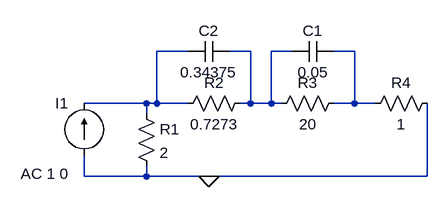
[diagram p0: schematic ej1.asc]
ej1.asc, the LTspice schematic file:
Version 4
SHEET 1 880 680
WIRE 96 32 48 32
WIRE 192 32 160 32
WIRE 256 32 224 32
WIRE 352 32 320 32
WIRE 32 112 -64 112
WIRE 48 112 48 32
WIRE 48 112 32 112
WIRE 96 112 48 112
WIRE 192 112 192 32
WIRE 192 112 176 112
WIRE 224 112 224 32
WIRE 224 112 192 112
WIRE 240 112 224 112
WIRE 352 112 352 32
WIRE 352 112 320 112
WIRE 384 112 352 112
WIRE 32 128 32 112
WIRE -64 224 -64 192
WIRE 32 224 32 208
WIRE 32 224 -64 224
WIRE 128 224 32 224
WIRE 464 224 464 112
WIRE 464 224 128 224
FLAG 128 224 0
SYMBOL res 16 112 R0
SYMATTR InstName R1
SYMATTR Value 2
SYMBOL res 192 96 R90
WINDOW 0 0 56 VBottom 2
WINDOW 3 32 56 VTop 2
SYMATTR InstName R2
SYMATTR Value 0.7273
SYMBOL res 336 96 R90
WINDOW 0 0 56 VBottom 2
WINDOW 3 32 56 VTop 2
SYMATTR InstName R3
SYMATTR Value 20
SYMBOL res 480 96 R90
WINDOW 0 0 56 VBottom 2
WINDOW 3 32 56 VTop 2
SYMATTR InstName R4
SYMATTR Value 1
SYMBOL cap 320 16 R90
WINDOW 0 0 32 VBottom 2
WINDOW 3 32 32 VTop 2
SYMATTR InstName C1
SYMATTR Value 0.05
SYMBOL cap 160 16 R90
WINDOW 0 0 32 VBottom 2
WINDOW 3 32 32 VTop 2
SYMATTR InstName C2
SYMATTR Value 0.34375
SYMBOL current -64 192 R180
WINDOW 0 24 80 Left 2
WINDOW 3 24 0 Left 2
WINDOW 123 24 -28 Left 2
WINDOW 39 0 0 Left 0
SYMATTR InstName I1
SYMATTR Value ""
SYMATTR Value2 AC 1 0

The netlist it stands for:
* ej1.asc
R1 N001 0 2
R2 N002 N001 0.7273
R3 N003 N002 20
R4 0 N003 1
C1 N003 N002 0.05
C2 N002 N001 0.34375
I1 0 N001 AC 1 0
.backanno
.end